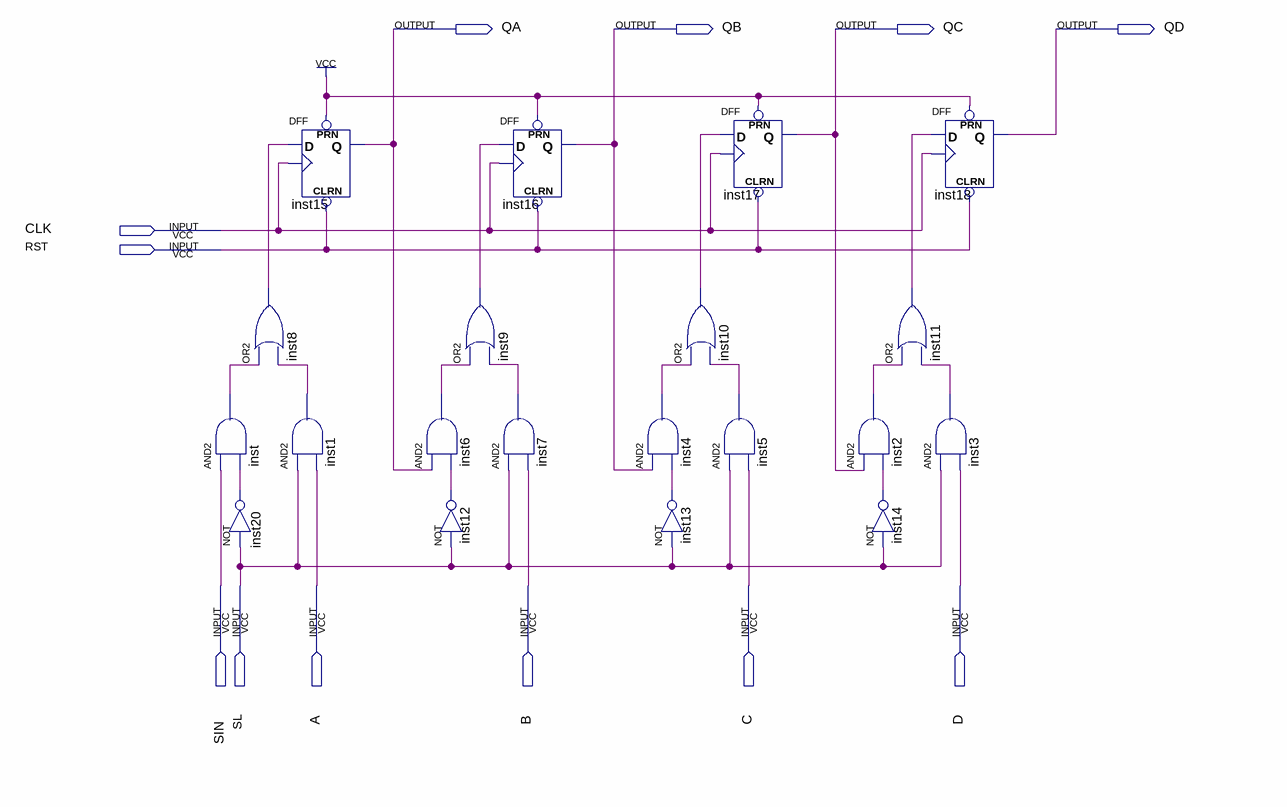
[diagram p0: schematic sheet]
// Quartus schematic Ex8.bdf as structural Verilog: 20 symbols, 12 pins
module Ex8 (
  input  CLK,
  input  RST,
  input  SIN,
  input  SL,
  input  A,
  input  B,
  input  C,
  input  D,
  output QA,
  output QB,
  output QC,
  output QD
);

  wire inst1_out, inst2_out, inst3_out, inst4_out, inst5_out, inst6_out, inst7_out, inst8_out, inst9_out,
       inst10_out, inst11_out, inst12_out, inst13_out, inst14_out, inst20_out, inst_out;

  and inst (inst_out, SIN, inst20_out);
  not inst20 (inst20_out, SL);
  DFF inst15 (.CLRN(RST), .CLK(CLK), .D(inst8_out), .PRN(1'b1), .Q(QA));
  or inst8 (inst8_out, inst_out, inst1_out);
  and inst1 (inst1_out, SL, A);
  or inst9 (inst9_out, inst6_out, inst7_out);
  and inst6 (inst6_out, QA, inst12_out);
  not inst12 (inst12_out, SL);
  DFF inst16 (.CLRN(RST), .CLK(CLK), .D(inst9_out), .PRN(1'b1), .Q(QB));
  and inst7 (inst7_out, SL, B);
  or inst10 (inst10_out, inst4_out, inst5_out);
  and inst4 (inst4_out, QB, inst13_out);
  not inst13 (inst13_out, SL);
  DFF inst17 (.CLRN(RST), .CLK(CLK), .D(inst10_out), .PRN(1'b1), .Q(QC));
  and inst5 (inst5_out, SL, C);
  or inst11 (inst11_out, inst2_out, inst3_out);
  and inst2 (inst2_out, QC, inst14_out);
  not inst14 (inst14_out, SL);
  DFF inst18 (.CLRN(RST), .CLK(CLK), .D(inst11_out), .PRN(1'b1), .Q(QD));
  and inst3 (inst3_out, SL, D);
endmodule
